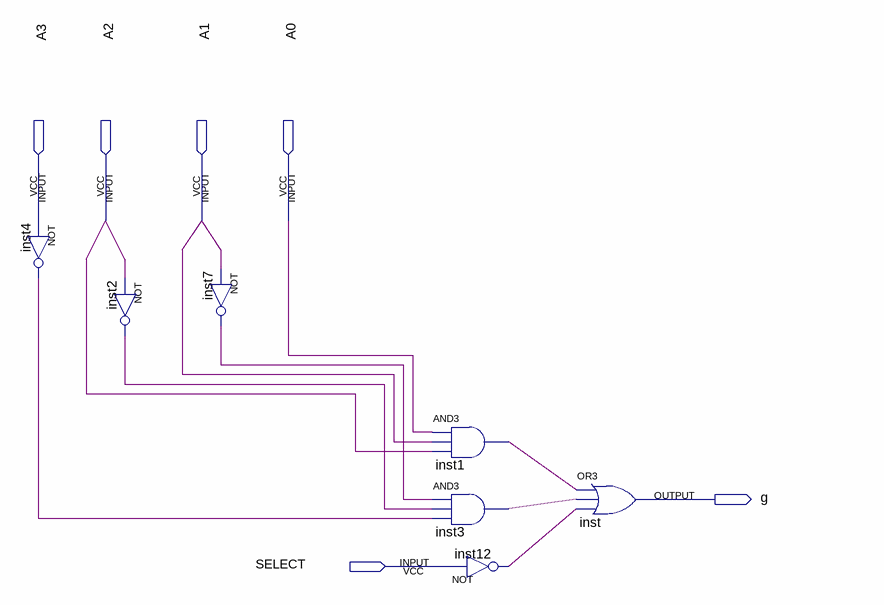
[diagram p0: schematic sheet]
// Quartus schematic segment_g.bdf as structural Verilog: 7 symbols, 6 pins
module segment_g (
  input  A3,
  input  A2,
  input  A1,
  input  A0,
  input  SELECT,
  output g
);

  wire inst1_out, inst2_out, inst3_out, inst4_out, inst7_out, inst12_out;

  not inst4 (inst4_out, A3);
  not inst2 (inst2_out, A2);
  not inst7 (inst7_out, A1);
  and inst1 (inst1_out, A0, A1, A2);
  and inst3 (inst3_out, inst7_out, inst2_out, inst4_out);
  not inst12 (inst12_out, SELECT);
  or inst (g, inst1_out, inst3_out, inst12_out);
endmodule
